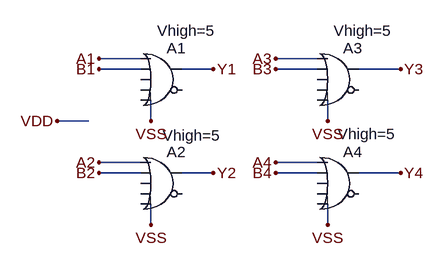
[diagram p0: schematic 74hc32.asc]
74hc32.asc, the LTspice schematic file:
Version 4
SHEET 1 1612 680
WIRE 256 0 192 0
WIRE 528 0 464 0
WIRE 256 16 192 16
WIRE 368 16 320 16
WIRE 528 16 464 16
WIRE 656 16 592 16
WIRE 176 96 128 96
WIRE 272 96 272 64
WIRE 544 96 544 64
WIRE 256 160 192 160
WIRE 528 160 464 160
WIRE 256 176 192 176
WIRE 368 176 320 176
WIRE 528 176 464 176
WIRE 656 176 592 176
WIRE 272 256 272 224
WIRE 544 256 544 224
FLAG 368 16 Y1
FLAG 368 176 Y2
FLAG 656 16 Y3
FLAG 656 176 Y4
FLAG 192 0 A1
FLAG 192 160 A2
FLAG 464 0 A3
FLAG 464 160 A4
FLAG 192 16 B1
FLAG 192 176 B2
FLAG 464 16 B3
FLAG 464 176 B4
FLAG 272 96 VSS
FLAG 544 96 VSS
FLAG 544 256 VSS
FLAG 272 256 VSS
FLAG 128 96 VDD
SYMBOL Digital\\or 288 -32 R0
WINDOW 3 -6 -11 Left 2
SYMATTR Value Vhigh=5
SYMATTR InstName A1
SYMBOL Digital\\or 288 128 R0
WINDOW 3 2 -10 Left 2
SYMATTR Value Vhigh=5
SYMATTR InstName A2
SYMBOL Digital\\or 560 -32 R0
WINDOW 3 -7 -11 Left 2
SYMATTR Value Vhigh=5
SYMATTR InstName A3
SYMBOL Digital\\or 560 128 R0
WINDOW 3 -1 -12 Left 2
SYMATTR Value Vhigh=5
SYMATTR InstName A4

The netlist it stands for:
* 74hc32.asc
A1 A1 B1 VSS VSS VSS VSS Y1 VSS OR Vhigh=5
A2 A2 B2 VSS VSS VSS VSS Y2 VSS OR Vhigh=5
A3 A3 B3 VSS VSS VSS VSS Y3 VSS OR Vhigh=5
A4 A4 B4 VSS VSS VSS VSS Y4 VSS OR Vhigh=5
.backanno
.end